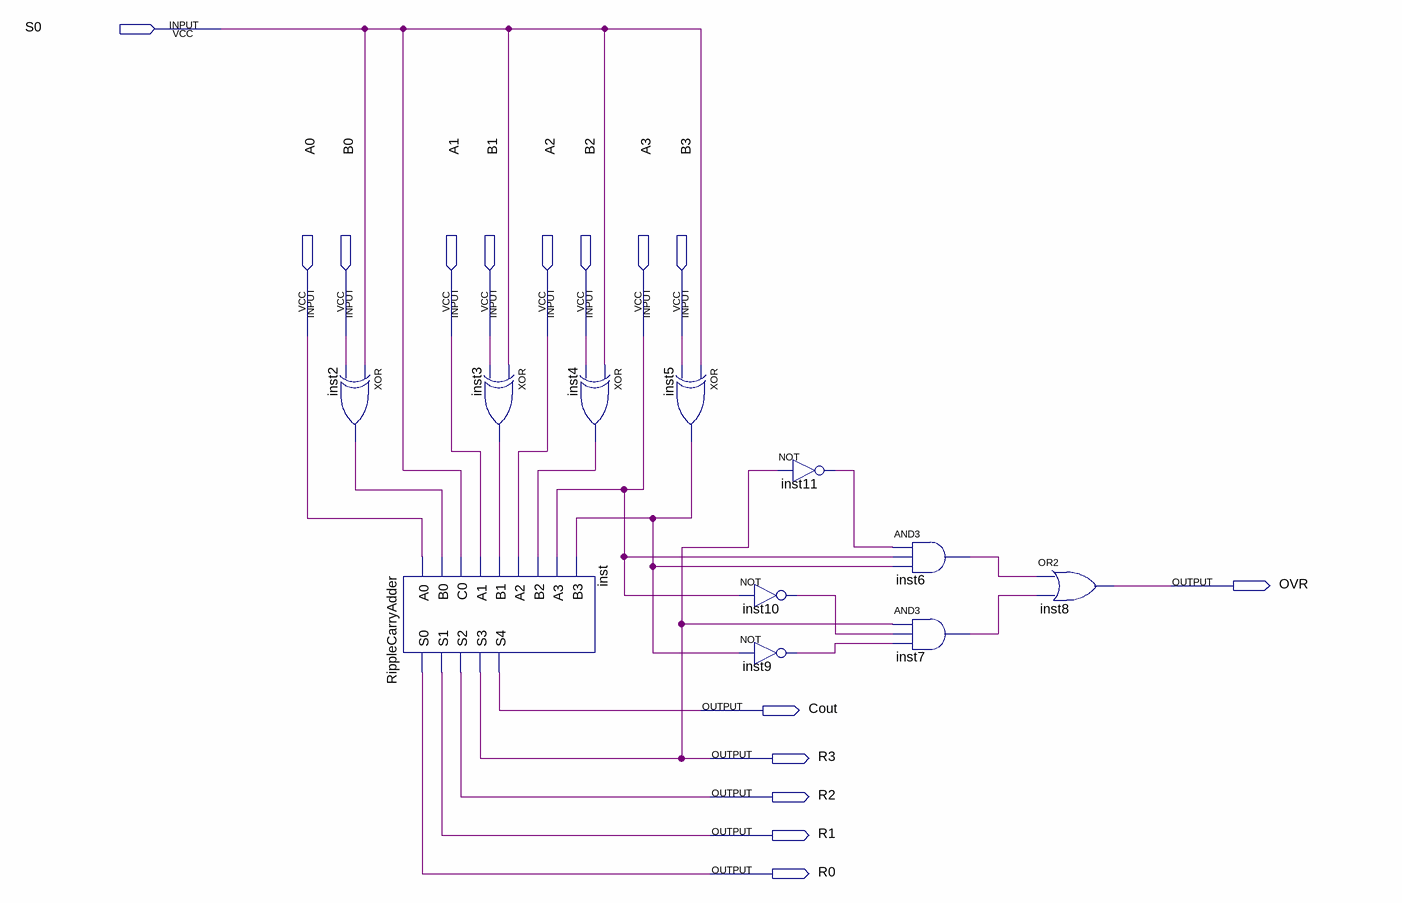
[diagram p0: schematic sheet]
// Quartus schematic Adder_Subtractor.bdf as structural Verilog: 11 symbols, 15 pins
module Adder_Subtractor (
  input  S0,
  input  A0,
  input  B0,
  input  A1,
  input  B1,
  input  A2,
  input  B2,
  input  A3,
  input  B3,
  output OVR,
  output Cout,
  output R3,
  output R2,
  output R1,
  output R0
);

  wire inst2_out, inst3_out, inst4_out, inst5_out, inst6_out, inst7_out, inst9_out, inst10_out, inst11_out;

  xor inst2 (inst2_out, S0, B0);
  RippleCarryAdder inst (
    .A0(A0), .B0(inst2_out), .C0(S0), .A1(A1), .B1(inst3_out), .A2(A2), .B2(inst4_out), .A3(A3),
    .B3(inst5_out), .S0(R0), .S1(R1), .S2(R2), .S3(R3), .S4(Cout));
  xor inst3 (inst3_out, S0, B1);
  xor inst4 (inst4_out, S0, B2);
  xor inst5 (inst5_out, S0, B3);
  not inst11 (inst11_out, R3);
  not inst10 (inst10_out, A3);
  not inst9 (inst9_out, inst5_out);
  and inst6 (inst6_out, inst11_out, A3, inst5_out);
  and inst7 (inst7_out, R3, inst10_out, inst9_out);
  or inst8 (OVR, inst6_out, inst7_out);
endmodule
